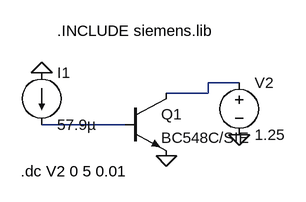
[diagram p0: schematic tbjsiemens(ICvsVCE)25mA.asc]
tbjsiemens(ICvsVCE)25mA.asc, the LTspice schematic file:
Version 4
SHEET 1 880 680
WIRE 320 96 272 96
WIRE 272 112 272 96
WIRE 272 112 208 112
WIRE 144 160 16 160
FLAG 208 208 0
FLAG 320 176 0
FLAG 16 80 0
SYMBOL voltage 320 80 R0
WINDOW 123 0 0 Left 2
WINDOW 39 0 0 Left 2
SYMATTR InstName V2
SYMATTR Value 1.25
SYMBOL npn 144 112 R0
SYMATTR InstName Q1
SYMATTR Value BC548C/SIE
SYMBOL current 16 80 R0
WINDOW 123 0 0 Left 2
WINDOW 39 0 0 Left 2
SYMATTR InstName I1
SYMATTR Value 57.9µ
TEXT 40 16 Left 2 !.INCLUDE siemens.lib
TEXT -16 232 Left 2 !.dc V2 0 5 0.01

The netlist it stands for:
* tbjsiemens(ICvsVCE)25mA.asc
V2 N001 0 1.25
Q1 N001 N002 0 0 BC548C/SIE
I1 0 N002 57.9µ
.model NPN NPN
.model PNP PNP
.lib standard.bjt
.INCLUDE siemens.lib
.dc V2 0 5 0.01
.backanno
.end